# Altium project timee_timer.PrjPcb
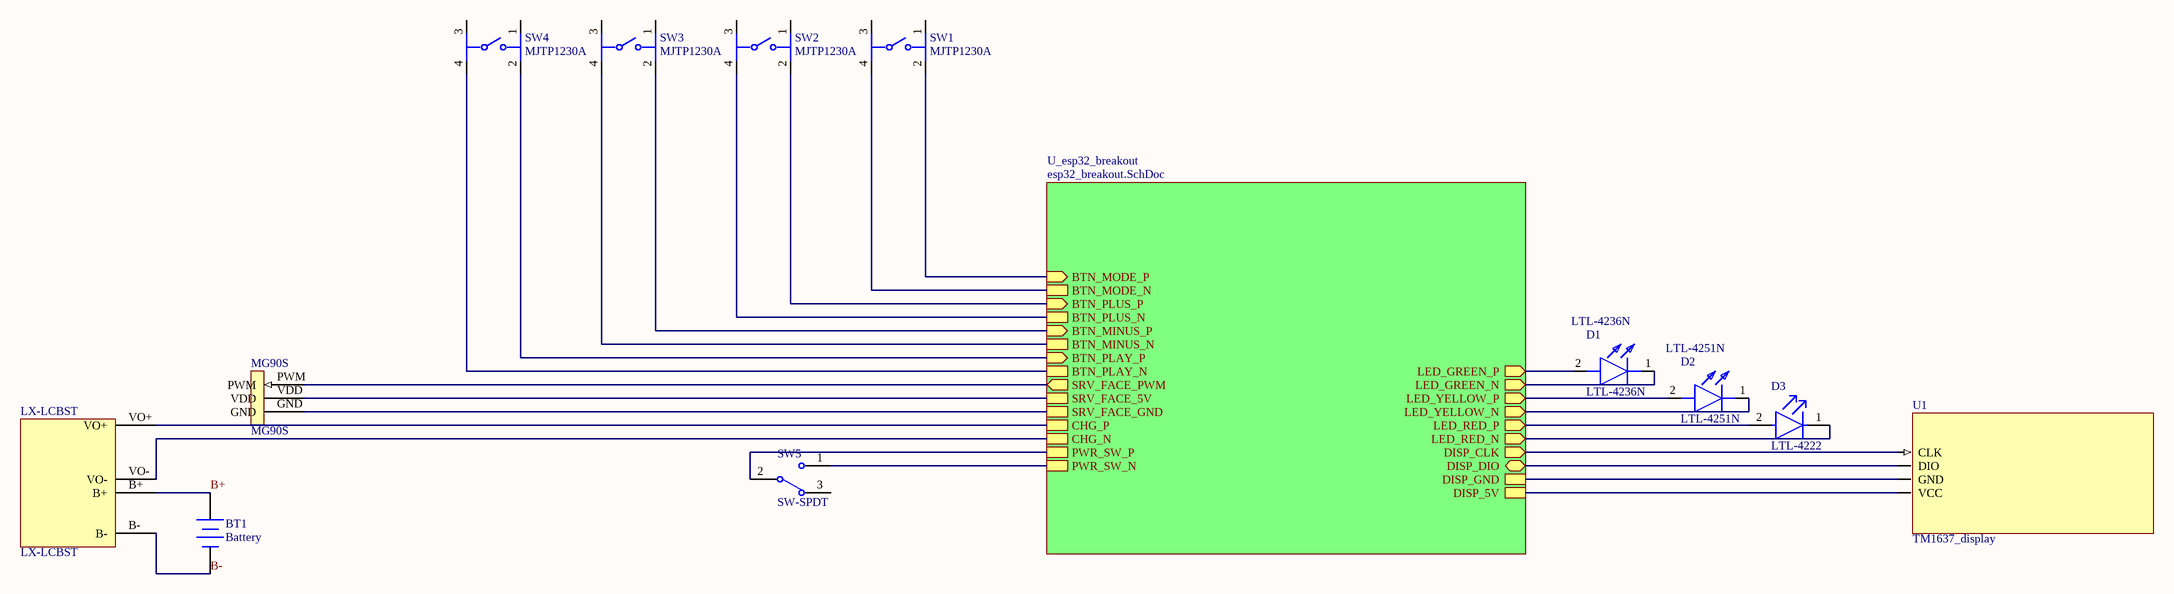
[diagram p0: tinee_timer.SchDoc]
3 sheets, 26 parts. Net scope: strictly hierarchical (ports join the sheet entries above them; power ports are local).
Board file: esp32_breakout.PcbDoc
Sheets:
  tinee_timer.SchDoc
    U_esp32_breakout = esp32_breakout.SchDoc
      U_ESP32_DevKitC_v4_shim = ESP32_DevKitC_v4_shim.SchDoc

## Sheet tinee_timer.SchDoc
size A1

### Parts
BT1  Battery  [BAT-2]
D1  LTL-4236N  [LTL4236N]
D2  LTL-4251N  [LTL4236N]
D3  LTL-4222  [FP-LTL-4222-MFG]
LX-LCBST  LX-LCBST
MG90S  MG90S
SW1  MJTP1230A  [FP-MJTP1230A-MFG]
SW2  MJTP1230A  [FP-MJTP1230A-MFG]
SW3  MJTP1230A  [FP-MJTP1230A-MFG]
SW4  MJTP1230A  [FP-MJTP1230A-MFG]
SW5  SW-SPDT  [TL36WW15050]
U1  TM1637_display

### Sub-sheets
U_esp32_breakout = esp32_breakout.SchDoc: LED_RED_N (out), LED_YELLOW_P (out), PWR_SW_P, DISP_CLK (out), LED_GREEN_N (out), CHG_P, BTN_PLAY_P (in), DISP_GND, LED_GREEN_P (out), SRV_FACE_GND, SRV_FACE_5V, BTN_PLAY_N, PWR_SW_N, LED_YELLOW_N (out), BTN_MODE_P (in), BTN_MODE_N, BTN_PLUS_N, DISP_5V, SRV_FACE_PWM (out), CHG_N, BTN_PLUS_P (in), DISP_DIO (bidir), LED_RED_P (out), BTN_MINUS_P (in), BTN_MINUS_N

### Nets
5V: MG90S.VDD SW5.1 U1.VCC ; sheet U_esp32_breakout/SRV_FACE_5V, sheet U_esp32_breakout/PWR_SW_N, sheet U_esp32_breakout/DISP_5V
GND: LX-LCBST.VO- MG90S.GND SW1.4 SW2.4 SW3.4 SW4.4 U1.GND ; sheet U_esp32_breakout/DISP_GND, sheet U_esp32_breakout/SRV_FACE_GND, sheet U_esp32_breakout/BTN_PLAY_N, sheet U_esp32_breakout/BTN_MODE_N, sheet U_esp32_breakout/BTN_PLUS_N, sheet U_esp32_breakout/CHG_N, sheet U_esp32_breakout/BTN_MINUS_N
B+: BT1.1(+) LX-LCBST.B+
B-: BT1.2(-) LX-LCBST.B-
BTN_MINUS: SW3.2 ; sheet U_esp32_breakout/BTN_MINUS_P
BTN_MODE: SW1.2 ; sheet U_esp32_breakout/BTN_MODE_P
BTN_PLAY: SW4.2 ; sheet U_esp32_breakout/BTN_PLAY_P
BTN_PLUS: SW2.2 ; sheet U_esp32_breakout/BTN_PLUS_P
CHG: LX-LCBST.VO+ SW5.2 ; sheet U_esp32_breakout/PWR_SW_P, sheet U_esp32_breakout/CHG_P
DISP_CLK_5V: U1.CLK ; sheet U_esp32_breakout/DISP_CLK
DISP_DIO_5V: U1.DIO ; sheet U_esp32_breakout/DISP_DIO
IO2: D2.1(K) ; sheet U_esp32_breakout/LED_YELLOW_N
IO4: D1.1(K) ; sheet U_esp32_breakout/LED_GREEN_N
IO14: MG90S.PWM ; sheet U_esp32_breakout/SRV_FACE_PWM
IO15: D3.1(C) ; sheet U_esp32_breakout/LED_RED_N
NetD1_2: D1.2(A) ; sheet U_esp32_breakout/LED_GREEN_P
NetD2_2: D2.2(A) ; sheet U_esp32_breakout/LED_YELLOW_P
NetD3_2: D3.2(A) ; sheet U_esp32_breakout/LED_RED_P

Not connected (* = marked no-connect by the designer): SW1 1 3; SW2 1 3; SW3 1 3; SW4 1 3; SW5 3

### Library data of the parts
BT1 = Battery: Multicell Battery; Published: 24-Mar-1999; LatestRevisionDate: 17-Jul-2002; LatestRevisionNote: Re-released for DXP Platform.; PackageReference: BAT-2; Publisher: Altium Limited; PackageDescription: Battery; 2 Leads
D1 = LTL-4236N: LED Round Dome Transparent Colorless Green 569nm 45° 2.1V 10mA DIP TH 3mm × 3mm × 5.85mm; Manufacturer_Name: Lite-On; Manufacturer: Diodes Inc.; Forward Current: 30mA; Forward Voltage: 2.8V; Lens Style: Clear; Luminous Intensity: 40mcd; Max Power Dissipation: 100mW; Number of Circuits: 1; Peak Wavelength: 565nm; Reverse Voltage: 5V; Datasheet Link: https://media.digikey.com/pdf/Data%20Sheets/Lite-On%20PDFs/LTL-4236N.pdf; Height: 5.85mm; Manufacturer_Part_Number: LTL-4236N; Mouser Part Number: 859-LTL-4236N; Mouser Price/Stock: https://www.mouser.co.uk/ProductDetail/Lite-On/LTL-4236N?qs=%252BY%252Bm5kuB5aiB3WZbX23AGA%3D%3D; Arrow Part Number: LTL-4236N; Arrow Price/Stock: https://www.arrow.com/en/products/ltl-4236n/lite-on-technology; Manufacturer Part Number: LTL-4236N; RoHS: Compliant; Category: LEDs; Stock 1: 973; Pricing 1: 1000=0.109, 3000=0.106, 5000=0.105, 15000=0.102, 25000=0.0993 (USD); Case/Package: T; China RoHS: Compliant; Color: Green; Country of Origin: Thailand; Depth: 3.2mm; Diameter: 3mm; Dominant Wavelength: 569nm; Export Control Classification Number (ECCN) Code: EAR99; Harmonized Tariff Schedule (HTS) Code: 8541.40.20.00; Illumination Color: Green; Introduction Date: 1992-03-31; Lead Free: Lead Free; Length: 3.2mm; Lens Color: Colorless; Lens Transparency: Clear; Lifecycle Status: Production; LTB Date: 2021-02-06; LTD Date: 2021-05-31; Max Operating Temperature: 100°C; Min Operating Temperature: -55°C; Mount: Through Hole; Number of Elements: 1; Number of LEDs: 1; Number of Pins: 2; Number of Terminals: 2; Packaging: Bulk; Power Dissipation: 100mW; Radiation Hardening: No; REACH SVHC: Affected; Schedule B: 8541402000, 8541402000|8541402000|8541402000|8541402000|8541402000; Shape: Round; Terminal Pitch: 2.54mm; Test Current: 10mA; Viewing Angle: 45°; Wavelength: 565nm; Width: 3.2mm; ComponentLink1URL: https://datasheet.octopart.com:443/LTL-4236N-Lite-On-datasheet-180603754.pdf?src-supplier=IHS; ComponentLink1Description: https://datasheet.octopart.com:443/LTL-4236N-Lite-On-datasheet-180603754.pdf?src-supplier=IHS; ComponentLink2URL: https://datasheet.octopart.com:443/LTL-4236N-Lite-On-datasheet-93175.pdf?src-supplier=TME; ComponentLink2Description: https://datasheet.octopart.com:443/LTL-4236N-Lite-On-datasheet-93175.pdf?src-supplier=TME; Stock 2: 28604; Pricing 2: 1=0.19, 10=0.132, 50=0.132, 100=0.09, 1000=0.066, 10000=0.052 (USD); Supplier 1: Future Electronics; Supplier Part Number 1: LTL-4236N
D2 = LTL-4251N: LED; Manufacturer_Name: Lite-On; Datasheet Link: https://media.digikey.com/pdf/Data%20Sheets/Lite-On%20PDFs/LTL-4251N.pdf; Height: 5.85mm; Manufacturer_Part_Number: LTL-4251N; Mouser Part Number: 859-LTL-4251N; Mouser Price/Stock: https://www.mouser.co.uk/ProductDetail/Lite-On/LTL-4251N?qs=ooQFeFo13p6X9Ku12Ljjeg%3D%3D; Arrow Part Number: LTL-4251N; Arrow Price/Stock: https://www.arrow.com/en/products/ltl-4251n/lite-on-technology?region=europe; Supplier 1: Arrow Electronics; Supplier Part Number 1: LTL-4251N
D3 = CMP-22017-000043-1: LED RED CLEAR T-1 T/H; Number of Elements: 1; Reverse Voltage: 5V; Lens Style: Dome; Power Dissipation: 100mW; Viewing Angle: 20°; Dominant Wavelength: 623nm; Wavelength: 635nm; Test Current: 10mA; Luminous Intensity: 29mcd; Forward Current: 20mA; Forward Voltage: 2V; Height: 6.55mm; Color: Red; Illumination Color: Red; Series: -; Packaging: Bulk; Case/Package: T; Mount: Through Hole; Length: 4mm; RoHS Compliant: Yes; Min Operating Temperature: -55°C; Lens Transparency: Clear; Max Operating Temperature: 100°C; Number of Pins: 2; Package Quantity: 1000; Number of LEDs: 1; Depth: 4mm; Lens Color: Red; Radiation Hardening: No
SW1-SW4 = CMP-47024-000004-1: SWITCH TACTILE SPST-NO 0.05A 12V; Mechanical Life: 100000Cycles; Throw Configuration: SPST; Actuator Length: 1.4mm; Switch Travel: 0.25mm; Actuator Color: Black; Operating Force: 160gf; Contact Resistance: 100mR; Actuator Type: Standard; Switch Function: Off-Mom; Actuator Material: Thermoplastic; Illumination Type: Non-Illuminated; Current Rating: 50mA; Min Operating Temperature: -20°C; Series: MJTP; Electrical Life: 100000Cycles; Mount: Through Hole; Packaging: Bulk; Color: Black; Package Quantity: 2000; Voltage Rating (DC): 12V; REACH SVHC: No SVHC; Orientation: Straight; Termination: PC Pin; Contact Material: Bronze; RoHS Compliant: Yes; Max Voltage Rating (DC): 12V; Max Operating Temperature: 70°C; Contact Plating: Silver
SW5 = SW-SPDT: SPDT Subminiature Toggle Switch, Right Angle Mounting, Vertical Actuation; Published: 24-Mar-1999; LatestRevisionDate: 17-Dec-2003; LatestRevisionNote: Schematic revised, PCB Footprint replaced.; DatasheetVersion: 05-Dec-2000; PackageReference: TL36WW15050; Publisher: Altium Limited; PackageDescription: Switch; 4 Leads; ComponentLink1Description: Manufacturer Link; ComponentLink1URL: http://www.apem.com

## Sheet esp32_breakout.SchDoc
size A1
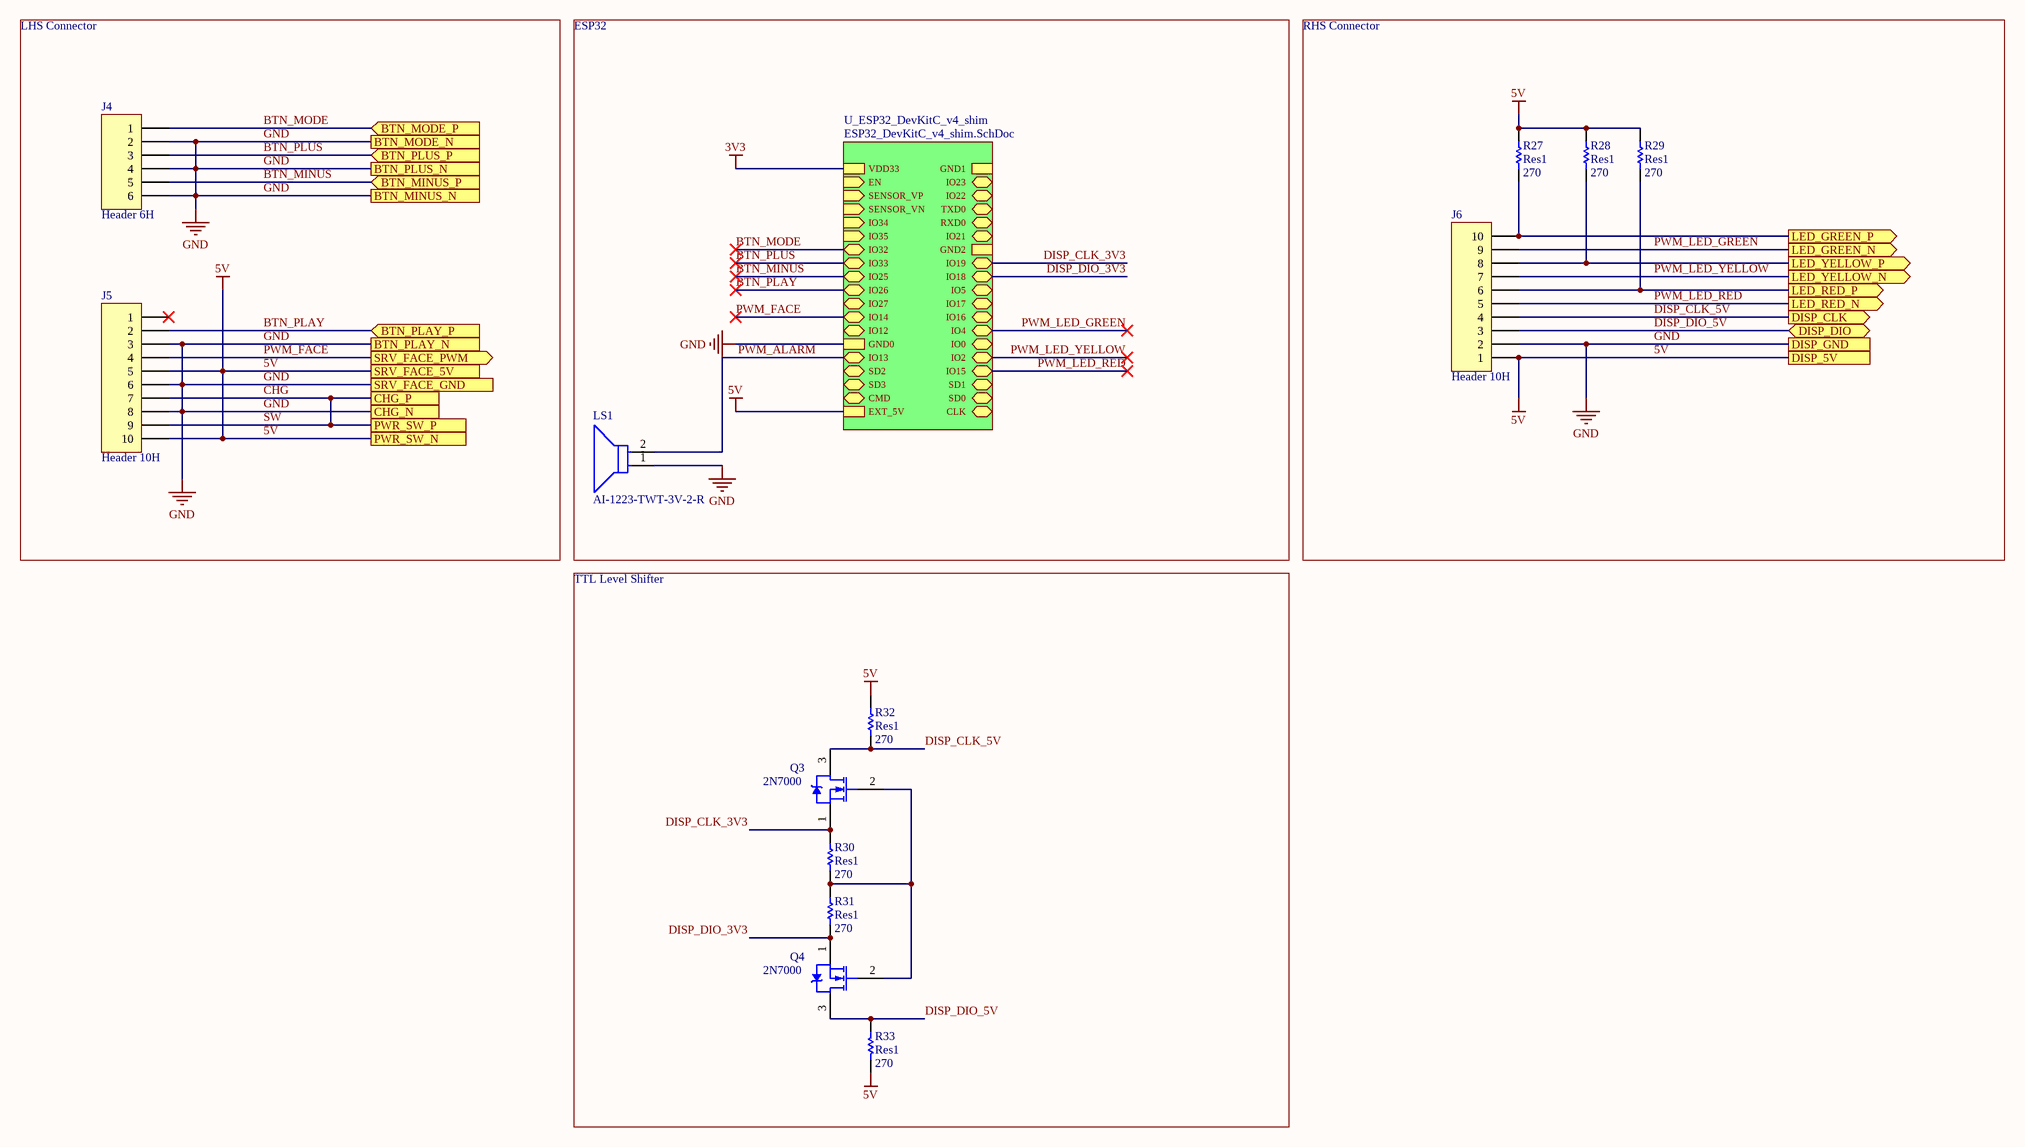
[diagram p1: esp32_breakout.SchDoc]

### Parts
J4  Header 6H  [HDR1X6H]
J5  Header 10H  [HDR1X10H]
J6  Header 10H  [HDR1X10H]
LS1  AI-1223-TWT-3V-2-R  [FP-AI-1223-TWT-3V-2-R-MFG]
Q3  2N7000  [ONSC-TO-92-3-29-11]
Q4  2N7000  [ONSC-TO-92-3-29-11]
R27  Res1  value 270  [AXIAL-0.3]
R28  Res1  value 270  [AXIAL-0.3]
R29  Res1  value 270  [AXIAL-0.3]
R30  Res1  value 270  [AXIAL-0.3]
R31  Res1  value 270  [AXIAL-0.3]
R32  Res1  value 270  [AXIAL-0.3]
R33  Res1  value 270  [AXIAL-0.3]

### Blocks framed on the sheet
LHS Connector: J4 J5
ESP32: LS1
RHS Connector: J6 R27-R29
TTL Level Shifter: Q3 Q4 R30-R33

### Sub-sheets
U_ESP32_DevKitC_v4_shim = ESP32_DevKitC_v4_shim.SchDoc: IO23 (bidir), IO22 (bidir), TXD0 (bidir), RXD0 (bidir), IO21 (bidir), IO19 (bidir), IO18 (bidir), IO5 (bidir), IO17 (bidir), IO16 (bidir), IO4 (bidir), IO0 (bidir), IO2 (bidir), IO15 (bidir), SD1 (bidir), SD0 (bidir), CLK (bidir), GND1, GND2, VDD33, EN (in), SENSOR_VP (in), SENSOR_VN (in), IO34 (in), IO35 (in), IO32 (bidir), IO33 (bidir), IO25 (bidir), IO26 (bidir), IO27 (bidir), IO14 (bidir), IO12 (bidir), GND0, IO13 (bidir), SD2 (bidir), SD3 (bidir), CMD (bidir), EXT_5V

### Ports
BTN_MINUS_N, BTN_MINUS_P (in), BTN_MODE_N, BTN_MODE_P (in), BTN_PLAY_N, BTN_PLAY_P (in), BTN_PLUS_N, BTN_PLUS_P (in), CHG_N, CHG_P, DISP_5V, DISP_CLK (out), DISP_DIO (bidir), DISP_GND, LED_GREEN_N (out), LED_GREEN_P (out), LED_RED_N (out), LED_RED_P (out), LED_YELLOW_N (out), LED_YELLOW_P (out), PWR_SW_N, PWR_SW_P, SRV_FACE_5V, SRV_FACE_GND, SRV_FACE_PWM (out)

### Nets
5V: J5.5 J5.10 J6.1 R27.2 R28.2 R29.2 R32.2 R33.2 ; port SRV_FACE_5V, port PWR_SW_N, port DISP_5V, sheet U_ESP32_DevKitC_v4_shim/EXT_5V
GND: J4.2 J4.4 J4.6 J5.3 J5.6 J5.8 J6.2 LS1.1(C) ; port BTN_MODE_N, port BTN_PLUS_N, port BTN_MINUS_N, port BTN_PLAY_N, port SRV_FACE_GND, port CHG_N, port DISP_GND, sheet U_ESP32_DevKitC_v4_shim/GND0
BTN_MINUS: J4.5 ; port BTN_MINUS_P, sheet U_ESP32_DevKitC_v4_shim/IO25
BTN_MODE: J4.1 ; port BTN_MODE_P, sheet U_ESP32_DevKitC_v4_shim/IO32
BTN_PLAY: J5.2 ; port BTN_PLAY_P, sheet U_ESP32_DevKitC_v4_shim/IO26
BTN_PLUS: J4.3 ; port BTN_PLUS_P, sheet U_ESP32_DevKitC_v4_shim/IO33
CHG: J5.7 J5.9 ; port CHG_P, port PWR_SW_P  [also labelled SW]
DISP_CLK_3V3: Q3.1(S) R30.2 ; sheet U_ESP32_DevKitC_v4_shim/IO19
DISP_CLK_5V: J6.4 Q3.3(D) R32.1 ; port DISP_CLK
DISP_DIO_3V3: Q4.1(S) R31.1 ; sheet U_ESP32_DevKitC_v4_shim/IO18
DISP_DIO_5V: J6.3 Q4.3(D) R33.1 ; port DISP_DIO
PWM_ALARM: LS1.2(A) ; sheet U_ESP32_DevKitC_v4_shim/IO13  [project net IO13]
PWM_FACE: J5.4 ; port SRV_FACE_PWM, sheet U_ESP32_DevKitC_v4_shim/IO14  [project net IO14]
PWM_LED_GREEN: J6.9 ; port LED_GREEN_N, sheet U_ESP32_DevKitC_v4_shim/IO4  [project net IO4]
PWM_LED_RED: J6.5 ; port LED_RED_N, sheet U_ESP32_DevKitC_v4_shim/IO15  [project net IO15]
PWM_LED_YELLOW: J6.7 ; port LED_YELLOW_N, sheet U_ESP32_DevKitC_v4_shim/IO2  [project net IO2]
NetD1_2: J6.10 R27.1 ; port LED_GREEN_P
NetD2_2: J6.8 R28.1 ; port LED_YELLOW_P
NetD3_2: J6.6 R29.1 ; port LED_RED_P
NetQ3_2: Q3.2(G) Q4.2(G) R30.1 R31.2

Not connected (* = marked no-connect by the designer): J5 1*

### Library data of the parts
J4 = Header 6H: Header, 6-Pin, Right Angle; LatestRevisionDate: 17-Jul-2002; LatestRevisionNote: Re-released for DXP Platform.; Publisher: Altium Limited
J5 J6 = Header 10H: Header, 10-Pin, Right Angle; LatestRevisionDate: 17-Jul-2002; LatestRevisionNote: Re-released for DXP Platform.; Publisher: Altium Limited
LS1 = CMP-103888-000003-1: BUZZER MAGNETIC 3V 12MM TH; Min Supply Voltage (DC): 2V; Operating Supply Current: 30mA; Max Supply Voltage (DC): 4V; Input Type: DC; Frequency: 2.3kHz; Series: AI; Nominal Supply Voltage (DC): 3V; Packaging: Tray; Max Operating Temperature: 70°C; Height: 7.5mm; Termination: PC Pins; Max Supply Current: 30mA; Mount: Through Hole; Diameter: 12mm; Voltage Rating: 3V; Sensing Method: Magnetic; Min Operating Temperature: -20°C; Contact Plating: Tin
Q3 Q4 = CMP-1058-00936-1: Small Signal MOSFET, 200 mA, 60 V, N-Channel, 3-Pin TO-92, Bulk Box; Manufacturer: On Semiconductor; Ciss Typ (pF): 60; VGS(th) Max (V): 3; Crss Typ (pF): 5; Channel Polarity: N Channel; VGS Max (V): 20; Configuration: Single; PD Max (W): 0.35; Coss Typ (pF): 25; ID Max (A): 0.2; PackageVersion: Rev. AM; ComponentLink3URL: http://www.onsemi.cn/pub_link/Collateral/2N6426-D.PDF; ComponentLink2URL: http://www.onsemi.com/pub_link/Collateral/2N7000-D.PDF; DatasheetVersion: Rev. 8; Mounting Technology: Through Hole; V(BR)DSS Min (V): 60; PartNumber: 2N7000; PackageDescription: 3-Pin Transistor Outline, Body 4.825 x 3.685 mm, Pitch 1.27 mm; ComponentLink2Description: Datasheet; ComponentLink1URL: http://www.onsemi.com/; PackageReference: TO-92-3-29-11_AM_SL; Packing: Bulk Box; ComponentLink1Description: Manufacturer URL; Package Type: TO-92; ComponentLink3Description: Package Specification
R27-R33 = Res1: Resistor; Published: 8-Jun-2000; LatestRevisionDate: 17-Jul-2002; LatestRevisionNote: Re-released for DXP Platform.; PackageReference: AXIAL-0.3; Publisher: Altium Limited; PackageDescription: Axial Device, Thru-Hole; 2 Leads; 0.3 in Pin Spacing

## Sheet ESP32_DevKitC_v4_shim.SchDoc
size A4
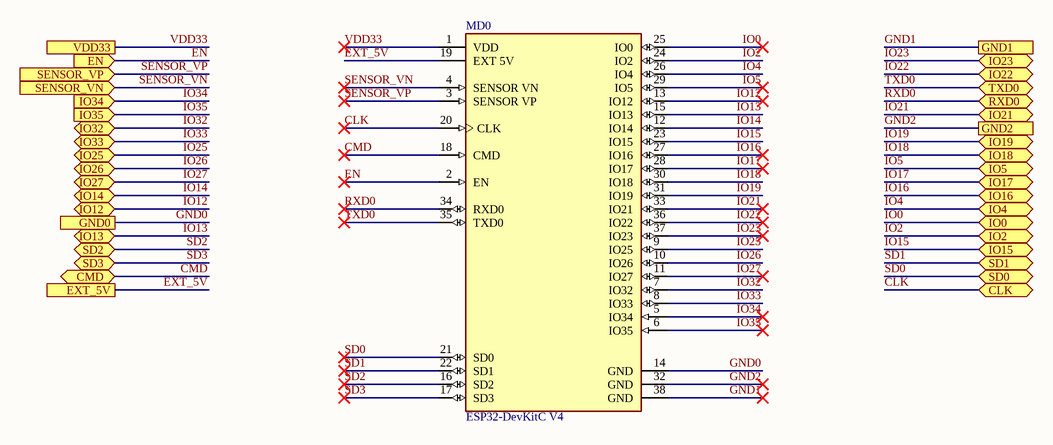
[diagram p2: ESP32_DevKitC_v4_shim.SchDoc]

### Parts
MD0  ESP32-DevKitC V4  [FP-ESP32-DevKitC_V4-MFG]

### Ports
CLK (bidir), CMD (bidir), EN (in), EXT_5V, GND0, GND1, GND2, IO0 (bidir), IO2 (bidir), IO4 (bidir), IO5 (bidir), IO12 (bidir), IO13 (bidir), IO14 (bidir), IO15 (bidir), IO16 (bidir), IO17 (bidir), IO18 (bidir), IO19 (bidir), IO21 (bidir), IO22 (bidir), IO23 (bidir), IO25 (bidir), IO26 (bidir), IO27 (bidir), IO32 (bidir), IO33 (bidir), IO34 (in), IO35 (in), RXD0 (bidir), SD0 (bidir), SD1 (bidir), SD2 (bidir), SD3 (bidir), SENSOR_VN (in), SENSOR_VP (in), TXD0 (bidir), VDD33

### Nets
EXT_5V: MD0.19(EXT_5V) ; port EXT_5V  [project net 5V]
GND0: MD0.14(GND) ; port GND0  [project net GND]
VDD33: MD0.1(VDD) ; port VDD33
CLK: MD0.20(CLK) ; port CLK
CMD: MD0.18(CMD) ; port CMD
EN: MD0.2(EN) ; port EN
GND1: MD0.38(GND) ; port GND1
GND2: MD0.32(GND) ; port GND2
IO0: MD0.25(IO0) ; port IO0
IO2: MD0.24(IO2) ; port IO2
IO4: MD0.26(IO4) ; port IO4
IO5: MD0.29(IO5) ; port IO5
IO12: MD0.13(IO12) ; port IO12
IO13: MD0.15(IO13) ; port IO13
IO14: MD0.12(IO14) ; port IO14
IO15: MD0.23(IO15) ; port IO15
IO16: MD0.27(IO16) ; port IO16
IO17: MD0.28(IO17) ; port IO17
IO18: MD0.30(IO18) ; port IO18  [project net DISP_DIO_3V3]
IO19: MD0.31(IO19) ; port IO19  [project net DISP_CLK_3V3]
IO21: MD0.33(IO21) ; port IO21
IO22: MD0.36(IO22) ; port IO22
IO23: MD0.37(IO23) ; port IO23
IO25: MD0.9(IO25) ; port IO25  [project net BTN_MINUS]
IO26: MD0.10(IO26) ; port IO26  [project net BTN_PLAY]
IO27: MD0.11(IO27) ; port IO27
IO32: MD0.7(IO32) ; port IO32  [project net BTN_MODE]
IO33: MD0.8(IO33) ; port IO33  [project net BTN_PLUS]
IO34: MD0.5(IO34) ; port IO34
IO35: MD0.6(IO35) ; port IO35
RXD0: MD0.34(RXD0) ; port RXD0
SD0: MD0.21(SD0) ; port SD0
SD1: MD0.22(SD1) ; port SD1
SD2: MD0.16(SD2) ; port SD2
SD3: MD0.17(SD3) ; port SD3
SENSOR_VN: MD0.4(SENSOR_VN) ; port SENSOR_VN
SENSOR_VP: MD0.3(SENSOR_VP) ; port SENSOR_VP
TXD0: MD0.35(TXD0) ; port TXD0

### Library data of the parts
MD0 = CMP-194065-000004-1: WiFi Development Tools (802.11) ESP32 General Development Kit, ESP32-WROOM-32 on the board; Manufacturer: Espressif; Number Of Adc Channels: 16; Max Supply Voltage: 5V; Bandwidth: 2.4-2.5GHz; Interface: I2C,SPI,UART,I2S; Max Frequency: 2.5GHz; Min Supply Voltage: 2.7V; Number Of Gpio: 22; Package: ESP32-DevKitC V4; Device Class L2: RF Semiconductors and Devices; Device Class L3: Transceivers; ComponentLink2Description: Datasheet; Temperature Range Low: -40°C; ComponentLink2URL: https://docs.espressif.com/projects/esp-idf/en/latest/get-started/get-started-devkitc.html; RoHS: TRUE; Category: UNK; Automotive: No; Device Class L1: Integrated Circuits (ICs); Manufacturer Part Number: ESP32-DevKitC V4; Octopart: https://octopart.com/esp32-devkitc+v4-espressif+systems-107467262; Lead Free: Yes; Temperature: -40°C to

## Nets that join several sheets
5V: tinee_timer (MG90S.VDD SW5.1 U1.VCC), esp32_breakout (8 pins), ESP32_DevKitC_v4_shim (MD0.19)
GND: tinee_timer (7 pins), esp32_breakout (8 pins), ESP32_DevKitC_v4_shim (MD0.14)
BTN_MINUS: tinee_timer (SW3.2), esp32_breakout (J4.5), ESP32_DevKitC_v4_shim (MD0.9)
BTN_MODE: tinee_timer (SW1.2), esp32_breakout (J4.1), ESP32_DevKitC_v4_shim (MD0.7)
BTN_PLAY: tinee_timer (SW4.2), esp32_breakout (J5.2), ESP32_DevKitC_v4_shim (MD0.10)
BTN_PLUS: tinee_timer (SW2.2), esp32_breakout (J4.3), ESP32_DevKitC_v4_shim (MD0.8)
CHG: tinee_timer (LX-LCBST.VO+ SW5.2), esp32_breakout (J5.7 J5.9)
DISP_CLK_3V3: esp32_breakout (Q3.1 R30.2), ESP32_DevKitC_v4_shim (MD0.31)
DISP_CLK_5V: tinee_timer (U1.CLK), esp32_breakout (J6.4 Q3.3 R32.1)
DISP_DIO_3V3: esp32_breakout (Q4.1 R31.1), ESP32_DevKitC_v4_shim (MD0.30)
DISP_DIO_5V: tinee_timer (U1.DIO), esp32_breakout (J6.3 Q4.3 R33.1)
IO2: tinee_timer (D2.1), esp32_breakout (J6.7), ESP32_DevKitC_v4_shim (MD0.24)
IO4: tinee_timer (D1.1), esp32_breakout (J6.9), ESP32_DevKitC_v4_shim (MD0.26)
IO13: esp32_breakout (LS1.2), ESP32_DevKitC_v4_shim (MD0.15)
IO14: tinee_timer (MG90S.PWM), esp32_breakout (J5.4), ESP32_DevKitC_v4_shim (MD0.12)
IO15: tinee_timer (D3.1), esp32_breakout (J6.5), ESP32_DevKitC_v4_shim (MD0.23)
NetD1_2: tinee_timer (D1.2), esp32_breakout (J6.10 R27.1)
NetD2_2: tinee_timer (D2.2), esp32_breakout (J6.8 R28.1)
NetD3_2: tinee_timer (D3.2), esp32_breakout (J6.6 R29.1)